# EAGLE design auxshiled1.8b (EAGLE 6.5.0)
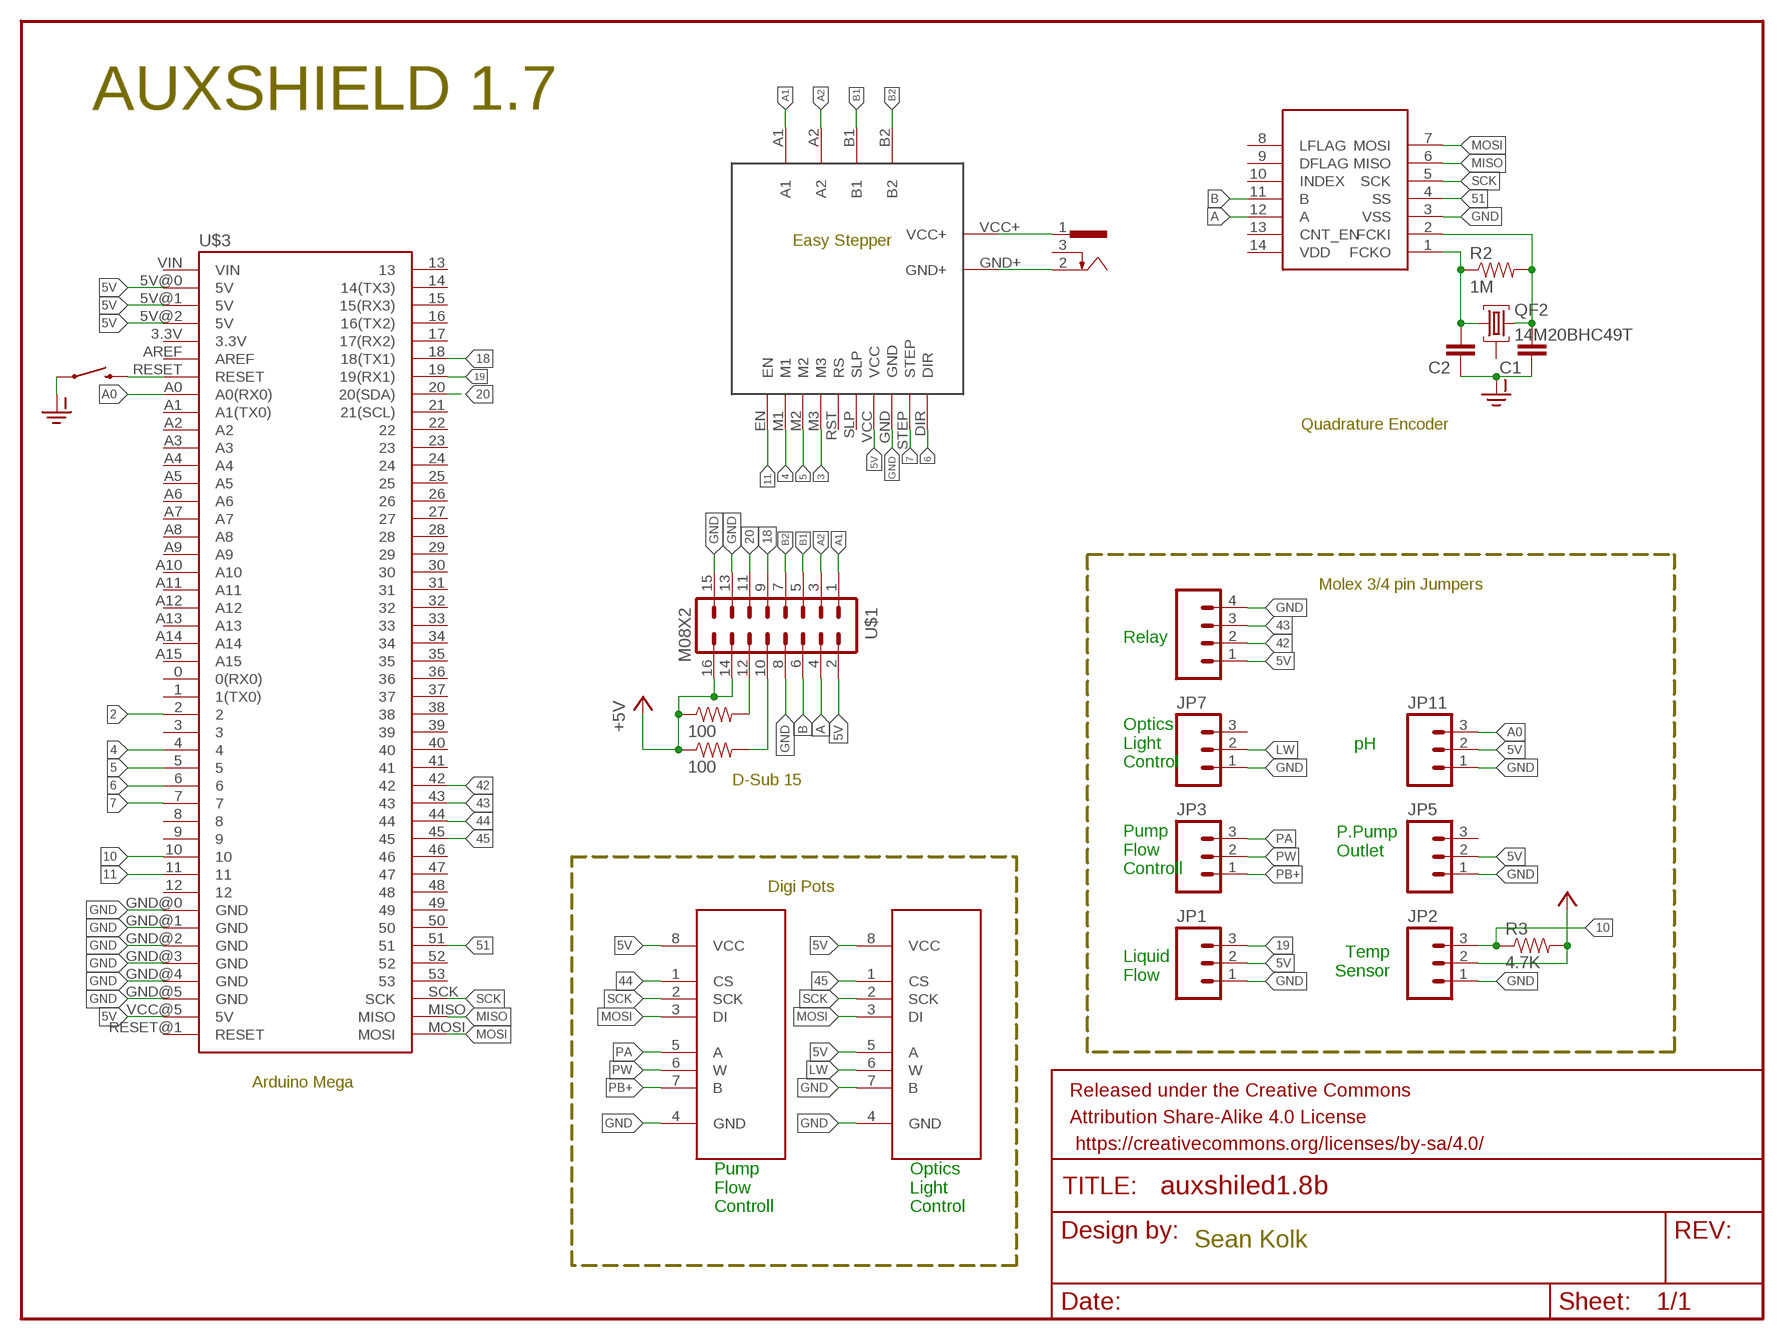
[diagram p0: schematic, sheet 1]

## Parts
C1  0.1UF-50V-20%(PTH)KIT-EZ  [CAP-PTH-SMALL-KIT]
C2  0.1UF-50V-20%(PTH)KIT-EZ  [CAP-PTH-SMALL-KIT]
FRAME1  FRAME-LETTER  [CREATIVE_COMMONS]
JP1  M03POLAR  [MOLEX-1X3]
JP2  M03POLAR  [MOLEX-1X3]
JP3  M03POLAR  [MOLEX-1X3]
JP5  M03POLAR  [MOLEX-1X3]
JP7  M03POLAR  [MOLEX-1X3]
JP11  M03POLAR  [MOLEX-1X3]
PUMPDIGIPOT  MCP41XXXDIL  [DIL-08]
QF2  14M20BHC49T  [HC49U]
R1  100  10OHM-1/4W-5%(PTH)  [AXIAL-0.3]
R2  1M  10OHM-1/4W-5%(PTH)  [AXIAL-0.3]
R3  4.7K  10OHM-1/4W-5%(PTH)  [AXIAL-0.3]
R4  100  10OHM-1/4W-5%(PTH)  [AXIAL-0.3]
RELAY  M04POLAR  [MOLEX-1X4]
S1  SWITCH-MOMENTARY-2PTH_EZ  [TACTILE-PTH-EZ]
U1  MCP41XXXDIL  [DIL-08]
U$1  M08X2  [2X8]
U$2  LS7366R  [SO014]
U$3  ARDUINO-MEGA-V2  [ARDUINO_MEGA-PRO-5V]
U$4  BIG_EASY_DRIVER  [BIG_EASY_DRIVER_PACK]
X1  SCD-014A  [SCD-014-A]

## Nets
2: U$3.2
3: U$4.M3
4: U$3.4 U$4.M1
5: U$3.5 U$4.M2
5V: JP1.2 JP5.2 JP11.2 PUMPDIGIPOT.8(VCC) RELAY.1 U1.5(A) U1.8(VCC) U$1.2 U$3.5V@0(5V) U$3.5V@1(5V) U$3.5V@2(5V) U$3.VCC@5(5V) U$4.VCC
6: U$3.6 U$4.DIR
7: U$3.7 U$4.STEP
10: JP2.3 R3.P$1 U$3.10
11: U$3.11 U$4.EN
18: U$1.9 U$3.18(18(TX1))
19: JP1.3 U$3.19(19(RX1))
20: U$1.11 U$3.20(20(SDA))
42: RELAY.2 U$3.42
43: RELAY.3 U$3.43
44: PUMPDIGIPOT.1(CS) U$3.44
45: U1.1(CS) U$3.45
51: U$2.4(SS) U$3.51
+5V: JP2.2 R1.P$1 R3.P$2 R4.P$1 U$1.14 U$1.16
A: U$1.4 U$2.12(A)
A0: JP11.3 U$3.A0(A0(RX0))
A1: U$1.1 U$4.A1
A2: U$1.3 U$4.A2
B: U$1.6 U$2.11(B)
B1: U$1.5 U$4.B1
B2: U$1.7 U$4.B2
GND: JP1.1 JP2.1 JP5.1 JP7.1 JP11.1 PUMPDIGIPOT.4(GND) RELAY.4 U1.4(GND) U1.7(B) U$1.8 U$1.13 U$1.15 U$2.3(VSS) U$3.GND@0(GND) U$3.GND@1(GND) U$3.GND@2(GND) U$3.GND@3(GND) U$3.GND@4(GND) U$3.GND@5(GND) U$4.GND
GND-ISO: C1.1 C2.1 S1.1
LW: JP7.2 U1.6(W)
MISO: U$2.6(MISO) U$3.MISO
MOSI: PUMPDIGIPOT.3(DI) U1.3(DI) U$2.7(MOSI) U$3.MOSI
N$1: U$4.VCC+ X1.1
N$2: U$4.GND+ X1.2
N$4: R1.P$2 U$1.10
N$9: S1.3 U$3.RESET
N$12: C1.2 QF2.3 R2.P$2 U$2.2(FCKI)
N$25: C2.2 QF2.1 R2.P$1 U$2.1(FCKO)
N$33: R4.P$2 U$1.12
PA: JP3.3 PUMPDIGIPOT.5(A)
PB+: JP3.1 PUMPDIGIPOT.7(B)
PW: JP3.2 PUMPDIGIPOT.6(W)
SCK: PUMPDIGIPOT.2(SCK) U1.2(SCK) U$2.5(SCK) U$3.SCK
Unconnected: JP5.3 JP7.3 QF2.2 U$2.8(LFLAG) U$2.9(DFLAG) U$2.10(INDEX) U$2.13(CNT_EN) U$2.14(VDD) U$3.0(0(RX0)) U$3.1(1(TX0)) U$3.3 U$3.3.3V U$3.8 U$3.9 U$3.12 U$3.13 U$3.14(14(TX3)) U$3.15(15(RX3)) U$3.16(16(TX2)) U$3.17(17(RX2)) U$3.21(21(SCL)) U$3.22 U$3.23 U$3.24 U$3.25 U$3.26 U$3.27 U$3.28 U$3.29 U$3.30 U$3.31 U$3.32 U$3.33 U$3.34 U$3.35 U$3.36 U$3.37 U$3.38 U$3.39 U$3.40 U$3.41 U$3.46 U$3.47 U$3.48 U$3.49 U$3.50 U$3.52 U$3.53 U$3.A1(A1(TX0)) U$3.A2 U$3.A3 U$3.A4 U$3.A5 U$3.A6 U$3.A7 U$3.A8 U$3.A9 U$3.A10 U$3.A11 U$3.A12 U$3.A13 U$3.A14 U$3.A15 U$3.AREF U$3.RESET@1(RESET) U$3.VIN U$4.RST(RS) U$4.SLP X1.3

## Notes on the sheet
- AUXSHIELD 1.7
- Easy Stepper
- Quadrature Encoder
- Molex 3/4 pin Jumpers
- Relay
- pH
- Optics
  Light 
  Control
- D-Sub 15
- P.Pump 
  Outlet
- Pump
  Flow
  Controll
- Digi Pots
- Temp
  Sensor
- Liquid 
  Flow
- Arduino Mega
- Pump
  Flow
  Controll
- Optics
  Light
  Control
- Sean Kolk

## Library data of the parts
C1 C2 = SparkFun-Capacitors:0.1UF-50V-20%(PTH): CAP-08370; PROD_ID: CAP-08370
FRAME1 = SparkFun-Aesthetics:FRAME-LETTER: Schematic Frame Standard 8.5x11 US Letter frame
JP1-JP3 JP5 JP7 JP11 = SparkFun-Connectors:M03: Header 3 Standard 3-pin 0.1" header. Use with straight break away headers (SKU : PRT-00116), right angle break away headers (PRT-00553), swiss pins (PRT-00743), machine pins (PRT-00117), and female headers (PRT-00115). Molex polarized connector foot print use with SKU : PRT-08232 with associated crimp pins and housings.
PUMPDIGIPOT U1 = SparkFun-AnalogIC:MCP41XXX: SPI controlled single digital potentiometer by Microchip PID: COM-10613
QF2 = crystal:14M20BHC49T: Monolithic Crystal Filters Source: www.vanlong.com; OC_FARNELL: unknown; OC_NEWARK: unknown
R1-R4 = SparkFun-Resistors:10OHM-1/4W-5%(PTH): RES-10698; PROD_ID: RES-10698; VALUE: 10
RELAY = SparkFun-Connectors:M04: Header 4 Standard 4-pin 0.1" header. Use with straight break away headers (SKU : PRT-00116), right angle break away headers (PRT-00553), swiss pins (PRT-00743), machine pins (PRT-00117), and female headers (PRT-00115). Molex polarized connector foot print use with SKU : PRT-08231 with associated crimp pins and housings. 1MM SMD Version SKU: PRT-10208
S1 = SparkFun-Electromechanical:SWITCH-MOMENTARY-2: Various NO switches- pushbuttons, reed, etc
U$1 = SparkFun-Connectors:M08X2: .1" headers, two rows of 8 each
U$2 = SparkFun-DigitalIC:LS7366R
U$3 = MEGASHIELD2:ARDUINO-MEGA-V2
U$4 = SparkFun-Boards:BIG_EASY_DRIVER
X1 = con-shiua-chyuan:SCD-014A: Power Jack 2.5mm; OC_FARNELL: unknown; OC_NEWARK: unknown

## Board
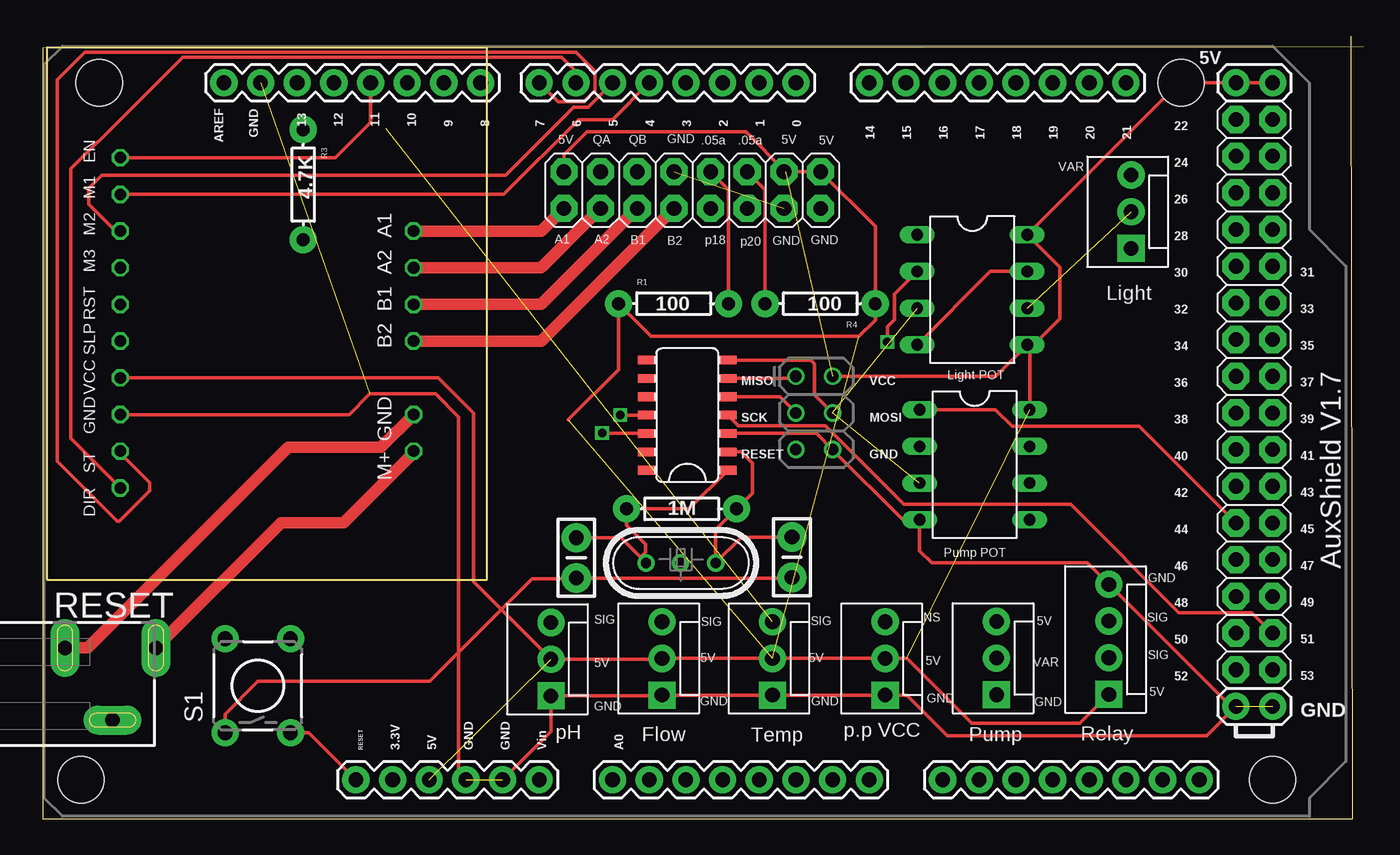
[diagram p1: board, top side]
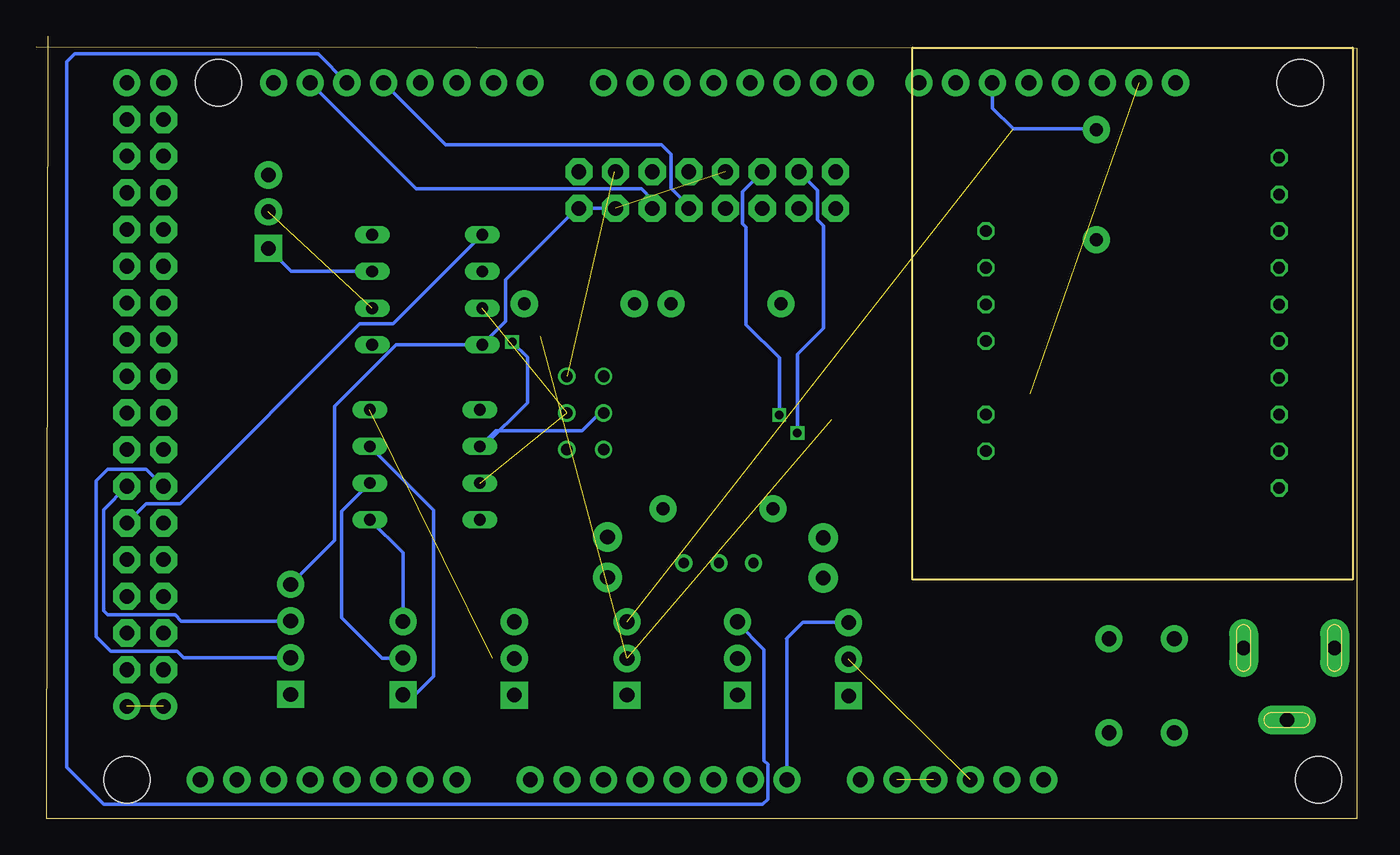
[diagram p2: board, bottom side, seen from below]

Size 91.48 x 54.18 mm. Coordinates in mm from the lower left corner, seen from the top.
Outline: 90.65,54.18 90.75,0 0,0 0,53.33
Outline: 91.48,53.44 0,53.34
Copper layers (1*16): Top 0.0356mm / dielectric 1.5011mm / Bottom 0.0356mm
Design rules "LaenPCBOrder (1)": minimum track width 6mil, minimum drill 13mil, track to track 6mil, track to pad 6mil, pad to pad 6mil, via to via 6mil, smd to smd 6mil, copper to edge 15mil, drill to drill 6mil, minimum pad ring 7mil, minimum via ring 7mil, stop-mask expansion 3mil, vias tented up to drill 0mil, thermal gap 10mil

### Footprints (pad centres in the part's own frame; a part is rotated, then mirrored left to right if it is on the bottom)
CAP-PTH-SMALL-KIT = drill 1.016 pad 2.032: 1 -1.397,0; 2 1.397,0
MOLEX-1X3 = drill 1.016 pad 1.88 square: 1 0,0 | drill 1.016 pad 1.88: 2 2.54,0; 3 5.08,0
DIL-08 = drill 0.813 long: 1 -3.81,-3.81; 2 -1.27,-3.81; 3 1.27,-3.81; 4 3.81,-3.81; 5 3.81,3.81; 6 1.27,3.81; 7 -1.27,3.81; 8 -3.81,3.81
HC49U = drill 0.7 pad 1.2: 1 -2.413,0; 2 -0.027,0; 3 2.413,0
AXIAL-0.3 = drill 0.9 pad 1.88: P$1 -3.81,0; P$2 3.81,0
MOLEX-1X4 = drill 1.016 pad 1.88 square: 1 0,0 | drill 1.016 pad 1.88: 2 2.54,0; 3 5.08,0; 4 7.62,0
TACTILE-PTH-EZ = drill 1.016 pad 1.88: 1 -3.251,2.261; 2 3.251,2.261; 3 -3.251,-2.261; 4 3.251,-2.261
2X8 = drill 1.016 pad 1.88 octagon: 1 0,0; 2 0,2.54; 3 2.54,0; 4 2.54,2.54; 5 5.08,0; 6 5.08,2.54; 7 7.62,0; 8 7.62,2.54; 9 10.16,0; 10 10.16,2.54; 11 12.7,0; 12 12.7,2.54; 13 15.24,0; 14 15.24,2.54; 15 17.78,0; 16 17.78,2.54
SO014 = smd 0.6 x 1.2: 1 -3.175,-2.8; 2 -1.905,-2.8; 3 -0.635,-2.8; 4 0.635,-2.8; 5 1.905,-2.8; 6 3.175,-2.8; 7 4.445,-2.8; 8 4.445,2.8; 9 3.175,2.8; 10 1.905,2.8; 11 0.635,2.8; 12 -0.635,2.8; 13 -1.905,2.8; 14 -3.175,2.8
ARDUINO_MEGA-PRO-5V = drill 1.016 pad 1.88: 0 52.07,50.8; 1 49.53,50.8; 2 46.99,50.8; 3 44.45,50.8; 3.3V 24.13,2.54; 4 41.91,50.8; 5 39.37,50.8; 5V@0 26.67,2.54; 5V@1 82.55,50.8; 5V@2 85.09,50.8; 6 36.83,50.8; 7 34.29,50.8; 8 30.226,50.8; 9 27.686,50.8; 10 25.146,50.8; 11 22.606,50.8; 12 20.066,50.8; 13 17.526,50.8; 14 57.15,50.8; 15 59.69,50.8; 16 62.23,50.8; 17 64.77,50.8; 18 67.31,50.8; 19 69.85,50.8; 20 72.39,50.8; 21 74.93,50.8; A0 39.37,2.54; A1 41.91,2.54; A2 44.45,2.54; A3 46.99,2.54; A4 49.53,2.54; A5 52.07,2.54; A6 54.61,2.54; A7 57.15,2.54; A8 62.23,2.54; A9 64.77,2.54; A10 67.31,2.54; A11 69.85,2.54; A12 72.39,2.54; A13 74.93,2.54; A14 77.47,2.54; A15 80.01,2.54; AREF 12.446,50.8; GND@0 29.21,2.54; GND@1 31.75,2.54; GND@2 82.55,7.62; GND@3 85.09,7.62; GND@4 14.986,50.8; RESET 21.59,2.54; VIN 34.29,2.54 | drill 1.016 pad 1.88 octagon: 22 82.55,48.26; 23 85.09,48.26; 24 82.55,45.72; 25 85.09,45.72; 26 82.55,43.18; 27 85.09,43.18; 28 82.55,40.64; 29 85.09,40.64; 30 82.55,38.1; 31 85.09,38.1; 32 82.55,35.56; 33 85.09,35.56; 34 82.55,33.02; 35 85.09,33.02; 36 82.55,30.48; 37 85.09,30.48; 38 82.55,27.94; 39 85.09,27.94; 40 82.55,25.4; 41 85.09,25.4; 42 82.55,22.86; 43 85.09,22.86; 44 82.55,20.32; 45 85.09,20.32; 46 82.55,17.78; 47 85.09,17.78; 48 82.55,15.24; 49 85.09,15.24; 50 82.55,12.7; 51 85.09,12.7; 52 82.55,10.16; 53 85.09,10.16 | drill 0.8: GND@5 54.61,25.4; MISO 52.07,30.48; MOSI 54.61,27.94; RESET@1 52.07,25.4; SCK 52.07,27.94; VCC@5 54.61,30.48 | hole 3.2: 3.81,50.8; 2.54,2.54; 78.74,50.8; 85.09,2.54
BIG_EASY_DRIVER_PACK = drill 0.8 octagon: A1 -5.08,15.24; A2 -2.54,15.24; B1 0,15.24; B2 2.54,15.24; DIR 12.7,-5.08; EN -10.16,-5.08; GND 7.62,-5.08; GND+ 7.62,15.24; M1 -7.62,-5.08; M2 -5.08,-5.08; M3 -2.54,-5.08; RST 0,-5.08; SLP 2.54,-5.08; STEP 10.16,-5.08; VCC 5.08,-5.08; VCC+ 10.16,15.24
SCD-014-A = drill 1 pad 2 long: 1 -2.5,13.8; 2 -2.5,7.5; 3 2.5,10.8

### Placement (x,y rotation side)
C1  51.9,18.1 90 top
C2  36.95,18.05 90 top
FRAME1  5.1,-14.95 0 top  (outside the outline)
JP1  42.9,8.55 90 top
JP2  50.55,8.55 90 top
JP3  66.06,8.57 90 top
JP5  58.35,8.55 90 top
JP7  75.39,39.48 90 top
JP11  35.2,8.5 90 top
PUMPDIGIPOT  64.55,24.5 270 top
QF2  44.2,17.7 0 top
R1  43.7,35.65 0 top
R2  44.25,21.45 0 top
R3  18.05,43.9 270 top
R4  53.85,35.65 180 top
RELAY  73.85,8.6 90 top
S1  14.9,9.2 90 top
U1  64.39,36.62 270 top
U$1  36.1,42.25 0 top
U$2  44.65,27.3 90 top
U$3  0.1,0.15 0 top
U$4  10.45,35.6 270 top
X1  -5.96,9.32 270 top

### Tracks (layer width: path | path; a pad name or v marks a point on that pad's centre or on a via)
4
  Top 0.254: U$4.M1 31.92,43.22 37.1,48.4 39.46,48.4 U$3.4
5
  Top 0.254: U$4.M2 5.07,40.68 3.2,42.55 3.2,43.65 4.1,44.55 32.05,44.55 36.75,49.25 37.77,49.25 U$3.5
5V  (3 unrouted)
  Top 0.254: RELAY.1 71.85,6.6 64.35,6.6 59.86,11.09 JP5.2 50.65,11.1 50.64,11.09 JP1.2 42.85,11.04 JP11.2 29.85,16.39 29.85,28.05 27.38,30.52 U$4.VCC | PUMPDIGIPOT.8 68.36,32.64 U1.5 | U1.5 68.66,32.8 70.45,34.6 70.45,38.17 U1.8 78.72,50.95 U$3.5V@1 U$3.5V@2 | U$1.2 36.1,45.95 37.7,47.55 48.7,47.55 51.45,44.8 | U$3.VCC@5 66.02,30.63 U1.5
6
  Top 0.254: U$3.6 36.93,51.72 35.95,52.7 9.7,52.7 3.85,46.85 3.8,46.85 1.95,45 1.95,26.32 U$4.DIR
7
  Top 0.254: U$4.STEP 5.37,25.28 7.4,23.25 7.4,22.7 5.3,20.6 5.15,20.6 1,24.75 1,51.15 2.9,53.05 36.95,53.05 38.25,51.75 38.25,50.4 37.5,49.65 35.69,49.65 U$3.7
10  (1 unrouted)
  Bottom 0.254: U$3.10 25.25,49.2 23.8,47.75 18.09,47.75 R3.P$1
11
  Top 0.254: U$4.EN 20.26,45.76 22.7,48.2 U$3.11
18
  Bottom 0.254: U$1.9 46.26,42.41 47.5,43.65 47.5,46 48.15,46.65 63.11,46.65 U$3.18
19
  Bottom 0.254: JP1.3 42.9,13.55 41.05,11.7 41.05,4 40.8,3.75 40.8,1.35 41.15,1 86.8,1 89.35,3.55 89.35,52.4 88.8,52.95 71.95,52.95 U$3.19
20
  Bottom 0.254: U$1.11 48.8,42.85 49.55,43.6 65.14,43.6 U$3.20
42
  Bottom 0.254: RELAY.2 81.24,11.14 81.7,11.6 86.3,11.6 87.3,12.6 87.3,23.4 86.5,24.2 83.84,24.2 U$3.42
43
  Bottom 0.254: RELAY.3 81.43,13.68 81.85,14.1 86.5,14.1 86.8,14.4 86.8,21.4 U$3.43
44
  Top 0.254: PUMPDIGIPOT.1 65.99,28.31 67.15,27.15 75.97,27.15 U$3.44
45
  Bottom 0.254: U$3.45 83.85,21.8 81.5,21.8 69.05,34.25 66.75,34.25 U1.1
51
  Top 0.254: U$3.51 85.15,12.85 83.75,14.25 78.7,14.25 71.2,21.75 59.65,21.75 54.2,27.2 48.19,27.2 U$2.4
+5V  (2 unrouted)
  Top 0.254: U$1.14 U$1.16 57.66,41.01 R4.P$1 57.66,34.51 56.55,33.4 42.14,33.4 R1.P$1 39.89,31.09 36.4,27.6
A  (via drill 0.6)
  Top 0.254: U$2.12 38.78,26.66 v38.75,26.7
  Bottom 0.254: v38.75,26.7 38.75,32.15 36.95,33.95 36.95,41.05 37.35,41.45 37.35,43.5 U$1.4
A0
  Bottom 0.254: JP11.3 38.37,13.58 39.35,12.6 39.47,12.48 | 39.47,12.48 39.5,12.45 | U$3.A0 39.47,12.48
A1
  Top 0.813: U$4.A1 34.53,40.68 U$1.1
A2
  Top 0.813: U$4.A2 34.53,38.14 U$1.3
B  (via drill 0.6)
  Top 0.254: U$2.11 40.02,27.93 v40,27.95
  Bottom 0.254: v40,27.95 40,31.9 42.3,34.2 42.3,40.95 42.55,41.2 42.55,43.42 U$1.6
B1
  Top 0.813: U$4.B1 34.53,35.6 U$1.5
B2
  Top 0.813: U$4.B2 34.53,33.06 U$1.7
GND  (4 unrouted)
  Top 0.254: U$2.3 53.59,26.66 U$3.GND@5 59.57,20.69 PUMPDIGIPOT.4 60.74,18.56 61.6,17.7 72.37,17.7 RELAY.4 82.3,7.77 U$3.GND@2 80.63,5.75 62.65,5.75 59.85,8.55 JP5.1 JP2.1 JP1.1 43.25,8.9 43.25,8.95 42.8,8.5 JP11.1 35.2,6.04 U$3.GND@1 | U$4.GND 21.23,27.98 22.65,29.4 27.2,29.4 28.8,27.8 28.8,3.2 U$3.GND@0 | U1.7 65.66,37.88 U1.4
  Bottom 0.254: U$1.13 U$1.15 54,42.25 58.95,37.3 58.95,34.43 U1.4 66.55,32.8 70.8,28.55 70.8,19.27 RELAY.4 | U1.7 73.8,37.88 JP7.1
GND-ISO
  Top 0.254: C1.1 51.85,16.65 C2.1 36.9,16.6 33.9,16.6 26.8,9.5 14.9,9.5 12.64,7.24 S1.1
LW  (1 unrouted)
MISO
  Top 0.254: U$2.6 52.02,30.48 U$3.MISO
MOSI  (2 unrouted)
  Top 0.254: U$2.7 53.2,31.75 53.45,31.5 53.45,29.35 U$3.MOSI
N$1
  Top 0.813: U$4.VCC+ 25.69,25.34 20.85,20.5 16.52,20.5 X1.1
N$2
  Top 0.813: X1.2 3.12,11.82 17,25.7 23.41,25.7 U$4.GND+
N$4
  Top 0.254: R1.P$2 47.51,43.54 U$1.10
N$9
  Top 0.254: S1.3 18.43,5.95 U$3.RESET
N$12
  Top 0.254: C1.2 48.41,19.5 QF2.3 46.61,20 R2.P$2 49.15,22.54 49.15,24.6 48.35,25.39 U$2.2
N$25
  Top 0.254: C2.2 40.04,19.45 41.39,18.09 | 41.39,18.09 QF2.1 | 41.39,18.09 41.75,18.45 41.75,19 40.44,20.31 R2.P$1 44.77,21.45 U$2.1
N$33
  Top 0.254: R4.P$2 50.04,43.55 U$1.12
PA
  Bottom 0.254: JP3.3 66.06,18.4 PUMPDIGIPOT.5
PB+
  Bottom 0.254: JP3.1 65.23,8.57 63.95,9.85 63.95,21.36 PUMPDIGIPOT.7
PW
  Bottom 0.254: JP3.2 67.51,11.11 70.3,13.9 70.3,21.29 PUMPDIGIPOT.6
SCK  (via drill 0.6)
  Top 0.254: U$2.5 51.05,29.2 U$3.SCK | v58.5,33 58.5,34.05 59,34.55 59,36.31 U1.2
  Bottom 0.254: U$3.SCK 52.41,28.09 53.65,26.85 59.66,26.85 PUMPDIGIPOT.2 60.48,25.77 57.45,28.8 57.45,31.95 v58.5,33

### Text on the board
tPlace: 5V | QA | QB | GND | .05a | .05a | 5V | 5V | VAR | A1 | A2 | B1 | B2 | p18 | p20 | GND | GND | Light | Light POT | Pump POT | AuxShield V1.7 | GND | RESET | NS | SIG | SIG | SIG | SIG | 5V | 5V | 5V | 5V | VAR | SIG | 5V | GND | GND | GND | GND | 5V | GND | pH | p.p VCC | Flow | Temp | Pump | Relay
DrillLegend_01-16: 01-16